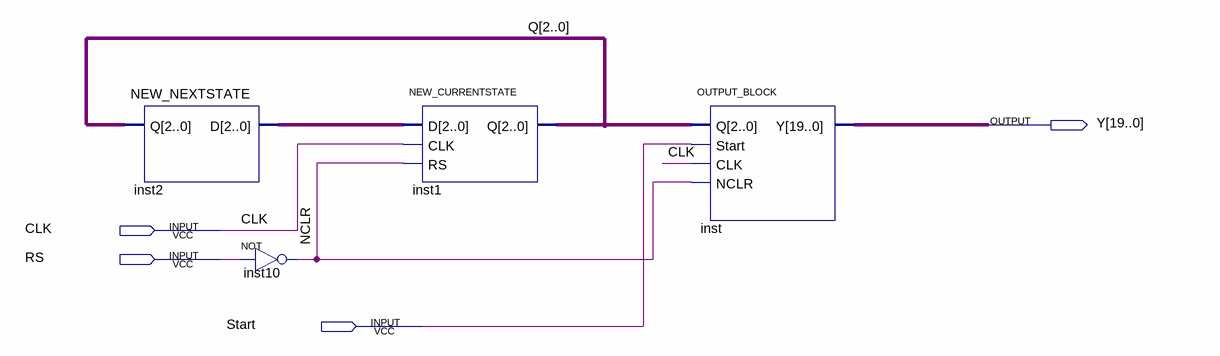
[diagram p0: schematic sheet]
// Quartus schematic PL_Final2.bdf as structural Verilog: 4 symbols, 4 pins
module PL_Final2 (
  input  CLK,
  input  RS,
  input  Start,
  output [19:0] Y
);

  wire NCLR;
  wire [2:0] inst2_d, Q;

  NEW_NEXTSTATE inst2 (.Q(Q), .D(inst2_d));
  not inst10 (NCLR, RS);
  NEW_CURRENTSTATE inst1 (.D(inst2_d), .CLK(CLK), .RS(NCLR), .Q(Q));
  OUTPUT_BLOCK inst (.Q(Q), .Start(Start), .CLK(CLK), .NCLR(NCLR), .Y(Y));
endmodule
